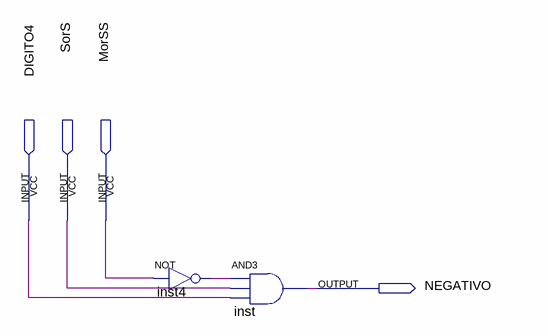
[diagram p0: schematic sheet]
// Quartus schematic SINALIZADOR.bdf as structural Verilog: 2 symbols, 4 pins
module SINALIZADOR (
  input  DIGITO4,
  input  SorS,
  input  MorSS,
  output NEGATIVO
);

  wire inst4_out;

  not inst4 (inst4_out, MorSS);
  and inst (NEGATIVO, inst4_out, SorS, DIGITO4);
endmodule
